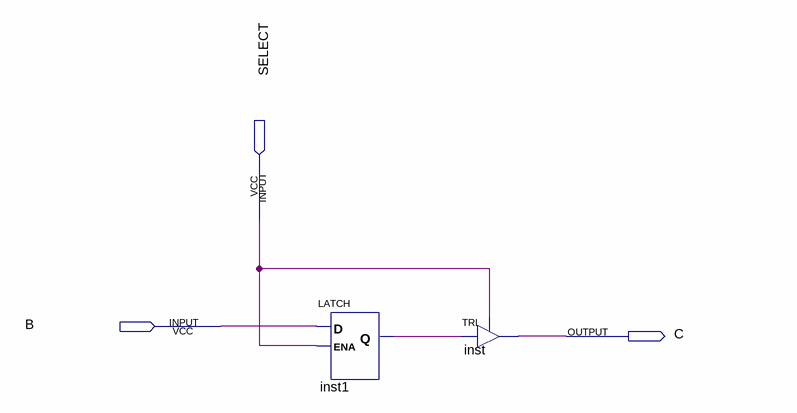
[diagram p0: schematic sheet]
// Quartus schematic DRAM_CELL.bdf as structural Verilog: 2 symbols, 3 pins
module DRAM_CELL (
  input  SELECT,
  input  B,
  output C
);

  wire inst1_q;

  LATCH inst1 (.D(B), .ENA(SELECT), .Q(inst1_q));
  TRI inst (.IN(inst1_q), .OE(SELECT), .OUT(C));
endmodule
